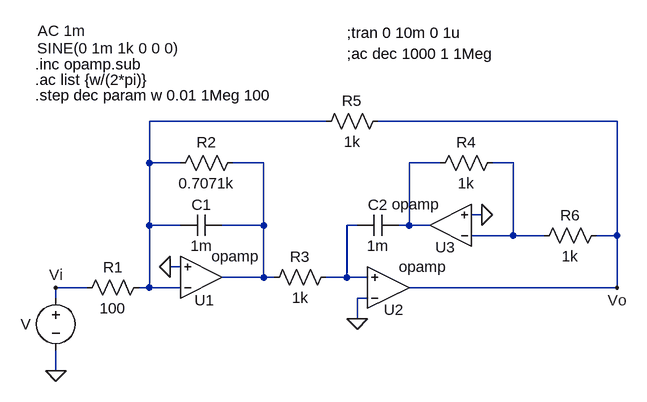
[diagram p0: schematic TS2_butter.asc]
TS2_butter.asc, the LTspice schematic file:
Version 4
SHEET 1 980 728
WIRE 480 112 208 112
WIRE 928 112 560 112
WIRE 208 176 208 112
WIRE 256 176 208 176
WIRE 384 176 336 176
WIRE 656 176 608 176
WIRE 768 176 736 176
WIRE 720 256 704 256
WIRE 208 272 208 176
WIRE 256 272 208 272
WIRE 384 272 384 176
WIRE 384 272 320 272
WIRE 528 272 512 272
WIRE 608 272 608 176
WIRE 608 272 592 272
WIRE 640 272 608 272
WIRE 768 288 768 176
WIRE 768 288 704 288
WIRE 816 288 768 288
WIRE 928 288 928 112
WIRE 928 288 896 288
WIRE 256 336 240 336
WIRE 384 352 384 272
WIRE 384 352 320 352
WIRE 400 352 384 352
WIRE 512 352 512 272
WIRE 512 352 480 352
WIRE 544 352 512 352
WIRE 112 368 64 368
WIRE 208 368 208 272
WIRE 208 368 192 368
WIRE 256 368 208 368
WIRE 928 368 928 288
WIRE 928 368 608 368
WIRE 64 384 64 368
WIRE 544 384 528 384
WIRE 528 416 528 384
WIRE 64 496 64 464
FLAG 64 368 Vi
FLAG 240 336 0
FLAG 528 416 0
FLAG 720 256 0
FLAG 928 368 Vo
FLAG 64 496 0
SYMBOL voltage 64 368 R0
WINDOW 123 -28 -395 Left 2
WINDOW 39 0 0 Left 2
WINDOW 0 -54 56 Left 2
WINDOW 3 -29 -368 Left 2
SYMATTR Value2 AC 1m
SYMATTR InstName V
SYMATTR Value SINE(0 1m 1k 0 0 0)
SYMBOL res 208 352 R90
WINDOW 0 0 56 VBottom 2
WINDOW 3 32 56 VTop 2
SYMATTR InstName R1
SYMATTR Value 100
SYMBOL res 496 336 R90
WINDOW 0 0 56 VBottom 2
WINDOW 3 32 56 VTop 2
SYMATTR InstName R3
SYMATTR Value 1k
SYMBOL cap 320 256 R90
WINDOW 0 0 32 VBottom 2
WINDOW 3 32 32 VTop 2
SYMATTR InstName C1
SYMATTR Value 1m
SYMBOL Opamps\\opamp 288 416 M180
WINDOW 0 20 29 Right 2
SYMATTR InstName U1
SYMBOL Opamps\\opamp 576 432 M180
WINDOW 0 24 30 Right 2
SYMATTR InstName U2
SYMBOL res 752 160 R90
WINDOW 0 0 56 VBottom 2
WINDOW 3 32 56 VTop 2
SYMATTR InstName R4
SYMATTR Value 1k
SYMBOL cap 592 256 R90
WINDOW 0 0 32 VBottom 2
WINDOW 3 32 32 VTop 2
SYMATTR InstName C2
SYMATTR Value 1m
SYMBOL res 352 160 R90
WINDOW 0 0 56 VBottom 2
WINDOW 3 32 56 VTop 2
SYMATTR InstName R2
SYMATTR Value 0.7071k
SYMBOL Opamps\\opamp 672 336 R180
WINDOW 0 24 30 Right 2
SYMATTR InstName U3
SYMBOL res 912 272 R90
WINDOW 0 0 56 VBottom 2
WINDOW 3 32 56 VTop 2
SYMATTR InstName R6
SYMATTR Value 1k
SYMBOL res 576 96 R90
WINDOW 0 0 56 VBottom 2
WINDOW 3 32 56 VTop 2
SYMATTR InstName R5
SYMATTR Value 1k
TEXT 512 -24 Left 2 !;tran 0 10m 0 1u
TEXT 512 8 Left 2 !;ac dec 1000 1 1Meg
TEXT 32 72 Left 2 !.step dec param w 0.01 1Meg 100
TEXT 32 48 Left 2 !.ac list {w/(2*pi)}
TEXT 32 24 Left 2 !.inc opamp.sub

The netlist it stands for:
* TS2_butter.asc
V Vi 0 SINE(0 1m 1k 0 0 0) AC 1m
R1 N001 Vi 100
R3 N005 N002 1k
C1 N002 N001 1m
XU1 N001 0 N002 opamp Aol=100K GBW=10Meg  ; pins invin noninvin out
XU2 0 N005 Vo opamp Aol=100K GBW=10Meg  ; pins invin noninvin out
R4 N004 N003 1k
C2 N003 N005 1m
R2 N002 N001 0.7071k
XU3 N004 0 N003 opamp Aol=100K GBW=10Meg  ; pins invin noninvin out
R6 Vo N004 1k
R5 Vo N001 1k
;tran 0 10m 0 1u
;ac dec 1000 1 1Meg
.step dec param w 0.01 1Meg 100
.ac list {w/(2*pi)}
.inc opamp.sub
.backanno
.end